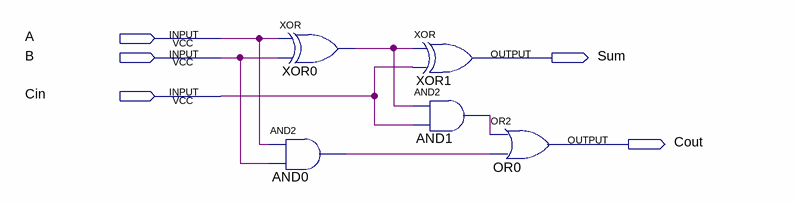
[diagram p0: schematic sheet]
// Quartus schematic FA.bdf as structural Verilog: 5 symbols, 5 pins
module FA (
  input  A,
  input  B,
  input  Cin,
  output Sum,
  output Cout
);

  wire AND0_out, AND1_out, XOR0_out;

  and AND0 (AND0_out, A, B);
  xor XOR0 (XOR0_out, A, B);
  xor XOR1 (Sum, XOR0_out, Cin);
  and AND1 (AND1_out, XOR0_out, Cin);
  or OR0 (Cout, AND1_out, AND0_out);
endmodule
